# Altium schematic sheet MCU_USB.SchDoc
size A3
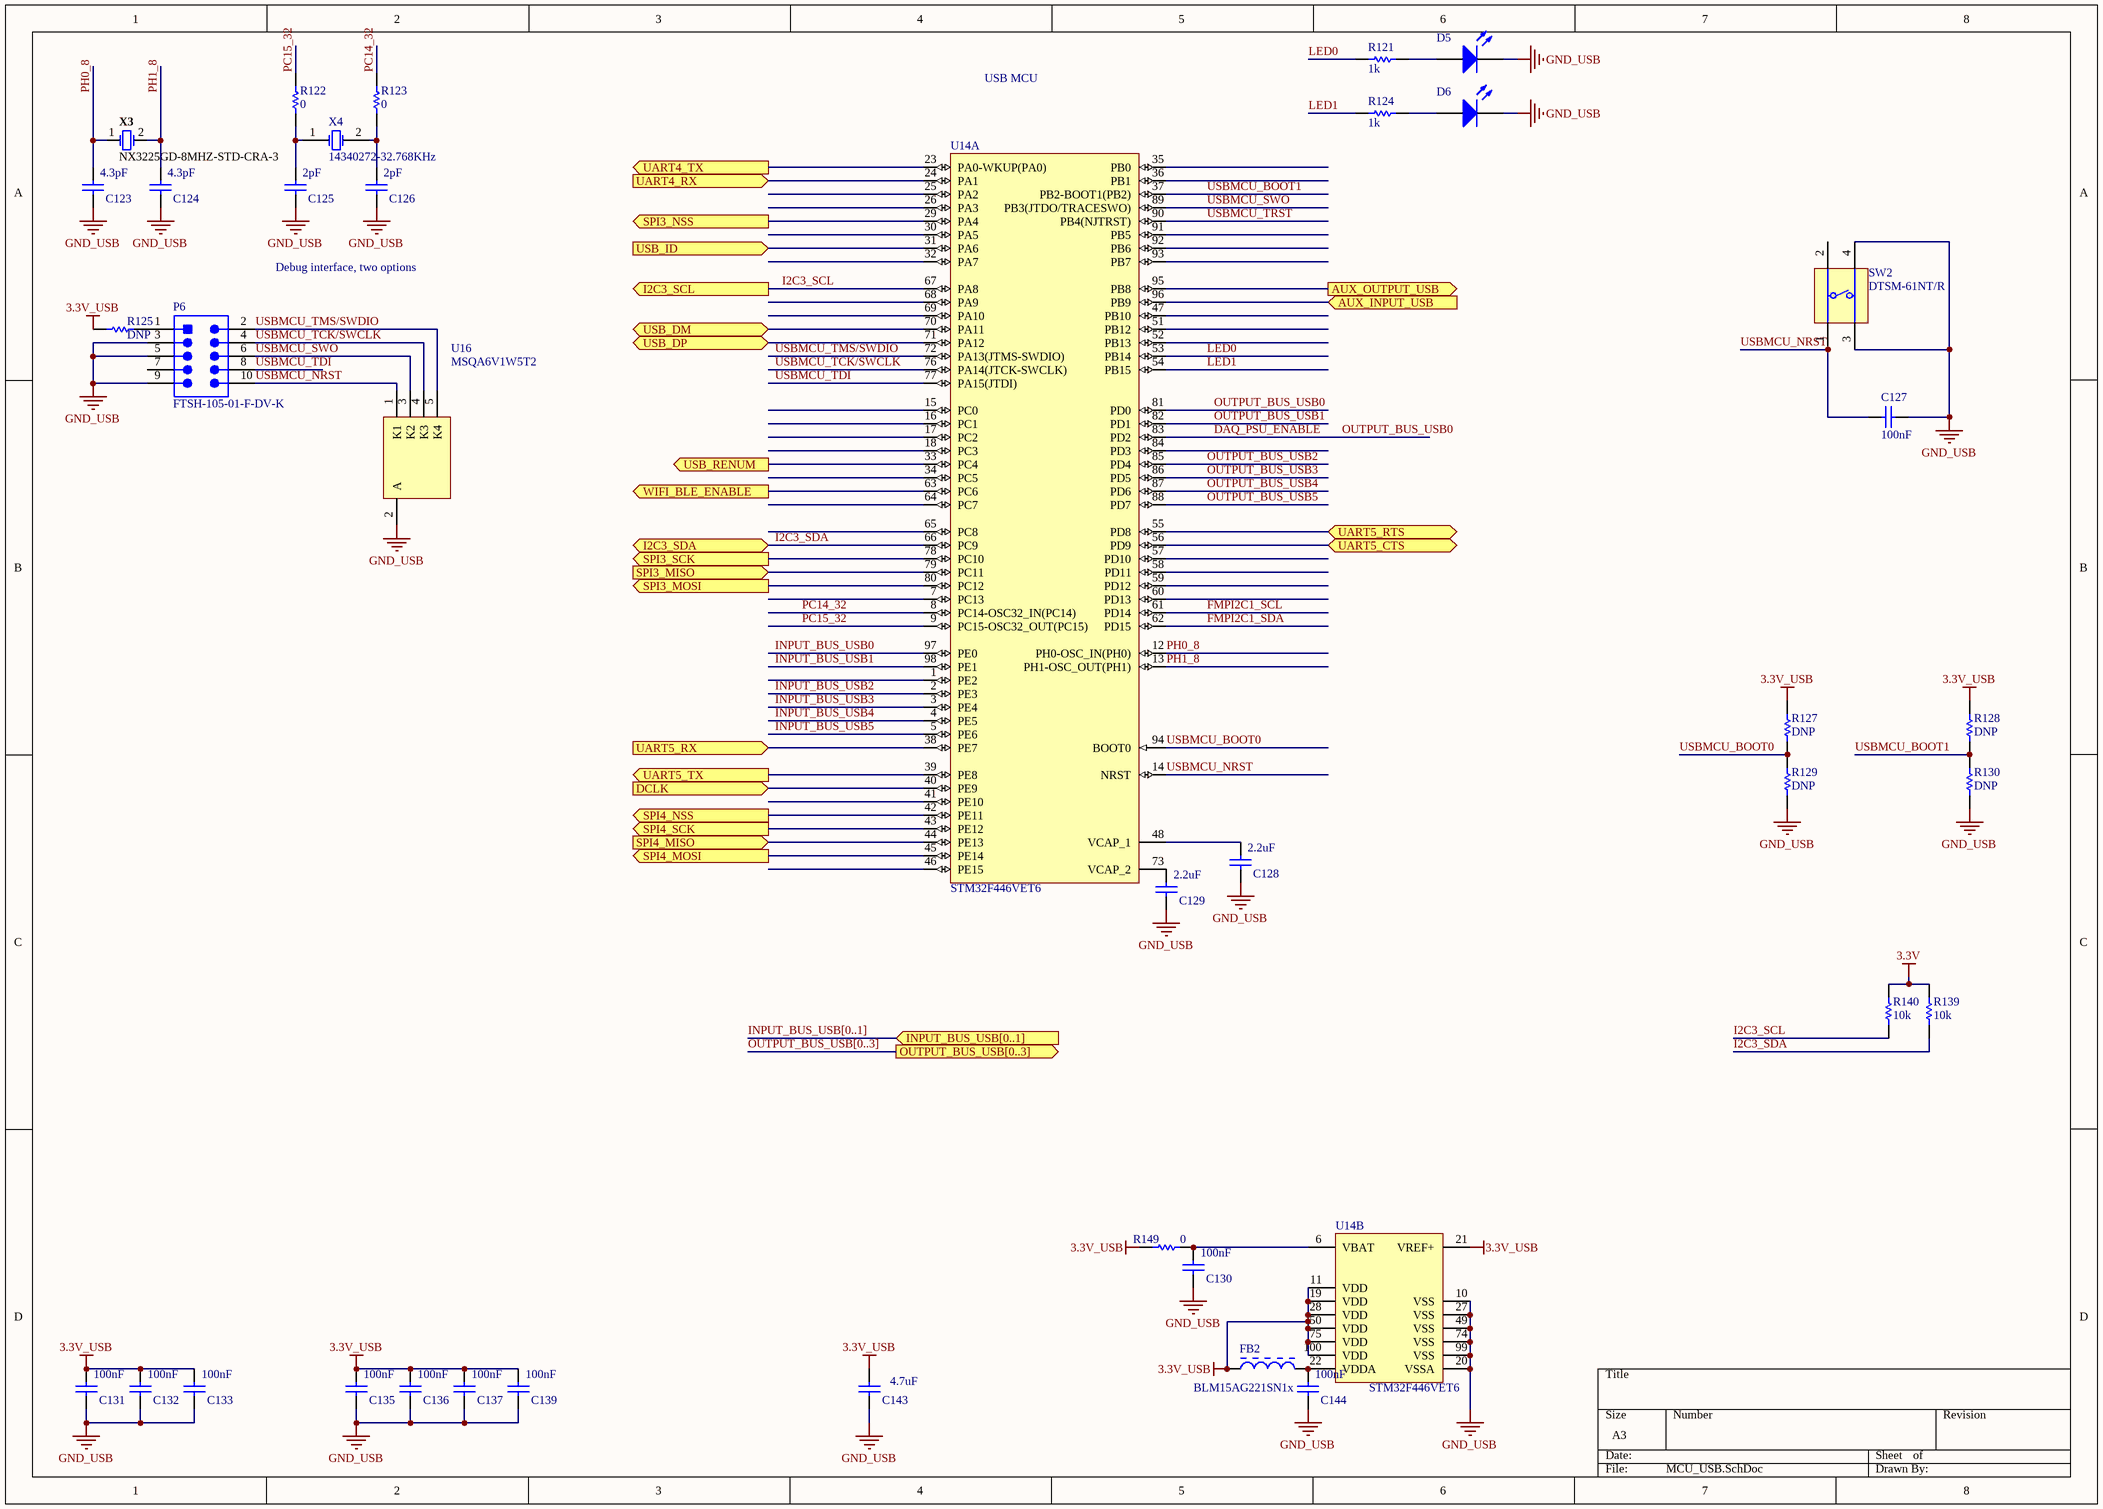
[diagram p0: MCU_USB.SchDoc]

## Parts
C123  value 4.3pF  [CAPC0402(1005)60_L]  (hidden comment: CAP0402)
C124  value 4.3pF  [CAPC0402(1005)60_L]  (hidden comment: CAP0402)
C125  value 2pF  [CAPC0402(1005)60_L]  (hidden comment: CAP0402)
C126  value 2pF  [CAPC0402(1005)60_L]  (hidden comment: CAP0402)
C127  value 100nF  [CAPC0402(1005)60_L]  (hidden comment: CAP0402)
C128  value 2.2uF  [CAPC0402(1005)60_L]  (hidden comment: CAP0402)
C129  value 2.2uF  [CAPC0402(1005)60_L]  (hidden comment: CAP0402)
C130  value 100nF  [CAPC0402(1005)60_L]  (hidden comment: CAP0402)
C131  value 100nF  [CAPC0402(1005)60_L]  (hidden comment: CAP0402)
C132  value 100nF  [CAPC0402(1005)60_L]  (hidden comment: CAP0402)
C133  value 100nF  [CAPC0402(1005)60_L]  (hidden comment: CAP0402)
C135  value 100nF  [CAPC0402(1005)60_L]  (hidden comment: CAP0402)
C136  value 100nF  [CAPC0402(1005)60_L]  (hidden comment: CAP0402)
C137  value 100nF  [CAPC0402(1005)60_L]  (hidden comment: CAP0402)
C139  value 100nF  [CAPC0402(1005)60_L]  (hidden comment: CAP0402)
C143  value 4.7uF  [CAPC0805(2012)145_L]  (hidden comment: CAP0805)
C144  value 100nF  [CAPC0402(1005)60_L]  (hidden comment: CAP0402)
D5  Green_LED_150060GS75000  [Green_LED_150060GS75000]  (value not drawn)
D6  Green_LED_150060GS75000  [Green_LED_150060GS75000]  (value not drawn)
FB2  BLM15AG221SN1x  [MURA-BLM15AG221SN1x_V]
P6  FTSH-105-01-F-DV-K  [SMTC-FTSH-105-01-L-DV-K_V]
R121  value 1k  [RESC0402(1005)_L]  (hidden comment: RES0402)
R122  value 0  [RESC0402(1005)_L]  (hidden comment: RES0402)
R123  value 0  [RESC0402(1005)_L]  (hidden comment: RES0402)
R124  value 1k  [RESC0402(1005)_L]  (hidden comment: RES0402)
R125  value DNP  [RESC0402(1005)_L]  (hidden comment: RES0402)
R127  value DNP  [RESC0402(1005)_L]  (hidden comment: RES0402)
R128  value DNP  [RESC0402(1005)_L]  (hidden comment: RES0402)
R129  value DNP  [RESC0402(1005)_L]  (hidden comment: RES0402)
R130  value DNP  [RESC0402(1005)_L]  (hidden comment: RES0402)
R139  value 10k  [RESC0402(1005)_L]  (hidden comment: RES0402)
R140  value 10k  [RESC0402(1005)_L]  (hidden comment: RES0402)
R149  value 0  [RESC0402(1005)_L]  (hidden comment: RES0402)
SW2  DTSM-61NT/R  [DIPT-DTSM-6_V]
U14  STM32F446VET6  [STM-LQFP100_M]  (parts A,B of 2)
U16  MSQA6V1W5T2  [ONSC-SC70-5-419A-02_V]
X3  NX3225GD-8MHZ-STD-CRA-3  [NDK-NX3225GD-8MHZ-STD-CRA-3_V]
X4  14340272-32.768KHz  [ITTI-14340272-32.768KHz-2_V]

## Ports
AUX_INPUT_USB (in), AUX_OUTPUT_USB (out), DCLK (in), I2C3_SCL (out), I2C3_SDA (bidir), INPUT_BUS_USB[0..1] (in), OUTPUT_BUS_USB[0..3] (out), SPI3_MISO (in), SPI3_MOSI (out), SPI3_NSS (out), SPI3_SCK (out), SPI4_MISO (in), SPI4_MOSI (out), SPI4_NSS (out), SPI4_SCK (out), UART4_RX (in), UART4_TX (out), UART5_CTS (bidir), UART5_RTS (bidir), UART5_RX (in), UART5_TX (out), USB_DM (bidir), USB_DP (bidir), USB_ID (in), USB_RENUM (out), WIFI_BLE_ENABLE (out)

## Nets
3.3V: R139.2 R140.2
3.3V_USB: C131.1 C132.1 C133.1 C135.1 C136.1 C137.1 C139.1 C143.2 FB2.1 R125.2 R127.2 R128.2 R149.2 U14.11(VDD) U14.19(VDD) U14.21(VREF+) U14.28(VDD) U14.50(VDD) U14.75(VDD) U14.100(VDD)
GND_USB: C123.2 C124.2 C125.2 C126.2 C127.2 C128.2 C129.2 C130.2 C131.2 C132.2 C133.2 C135.2 C136.2 C137.2 C139.2 C143.1 C144.2 D5.1 D6.1 P6.3 P6.5 P6.9 R129.1 R130.1 SW2.3(T3) SW2.4(T3) U14.10(VSS) U14.20(VSSA) U14.27(VSS) U14.49(VSS) U14.74(VSS) U14.99(VSS) U16.2(A)
AUX_INPUT_USB: U14.96(PB9) ; port AUX_INPUT_USB
AUX_OUTPUT_USB: U14.95(PB8) ; port AUX_OUTPUT_USB
DAQ_PSU_ENABLE: U14.81(PD0) U14.83(PD2)  [also labelled OUTPUT_BUS_USB0]
DCLK: U14.40(PE9) ; port DCLK
FMPI2C1_SCL: U14.61(PD14)
FMPI2C1_SDA: U14.62(PD15)
I2C3_SCL: R140.1 U14.67(PA8) ; port I2C3_SCL
I2C3_SDA: R139.1 U14.66(PC9) ; port I2C3_SDA
INPUT_BUS_USB0: U14.97(PE0)
INPUT_BUS_USB1: U14.98(PE1)
INPUT_BUS_USB2: U14.2(PE3)
INPUT_BUS_USB3: U14.3(PE4)
INPUT_BUS_USB4: U14.4(PE5)
INPUT_BUS_USB5: U14.5(PE6)
LED0: R121.1 U14.53(PB14)
LED1: R124.1 U14.54(PB15)
OUTPUT_BUS_USB1: U14.82(PD1)
OUTPUT_BUS_USB2: U14.85(PD4)
OUTPUT_BUS_USB3: U14.86(PD5)
OUTPUT_BUS_USB4: U14.87(PD6)
OUTPUT_BUS_USB5: U14.88(PD7)
PC14_32: R123.1 U14.8(PC14-OSC32_IN(PC14))
PC15_32: R122.1 U14.9(PC15-OSC32_OUT(PC15))
PH0_8: C123.1 U14.12(PH0-OSC_IN(PH0)) X3.1
PH1_8: C124.1 U14.13(PH1-OSC_OUT(PH1)) X3.2
SPI3_MISO: U14.79(PC11) ; port SPI3_MISO
SPI3_MOSI: U14.80(PC12) ; port SPI3_MOSI
SPI3_NSS: U14.29(PA4) ; port SPI3_NSS
SPI3_SCK: U14.78(PC10) ; port SPI3_SCK
SPI4_MISO: U14.44(PE13) ; port SPI4_MISO
SPI4_MOSI: U14.45(PE14) ; port SPI4_MOSI
SPI4_NSS: U14.42(PE11) ; port SPI4_NSS
SPI4_SCK: U14.43(PE12) ; port SPI4_SCK
UART4_RX: U14.24(PA1) ; port UART4_RX
UART4_TX: U14.23(PA0-WKUP(PA0)) ; port UART4_TX
UART5_CTS: U14.56(PD9) ; port UART5_CTS
UART5_RTS: U14.55(PD8) ; port UART5_RTS
UART5_RX: U14.38(PE7) ; port UART5_RX
UART5_TX: U14.39(PE8) ; port UART5_TX
USB_DM: U14.70(PA11) ; port USB_DM
USB_DP: U14.71(PA12) ; port USB_DP
USB_ID: U14.31(PA6) ; port USB_ID
USB_RENUM: U14.33(PC4) ; port USB_RENUM
USBMCU_BOOT0: R127.1 R129.2 U14.94(BOOT0)
USBMCU_BOOT1: R128.1 R130.2 U14.37(PB2-BOOT1(PB2))
USBMCU_NRST: C127.1 P6.10 SW2.1(T1) U14.14(NRST) U16.1(K1)
USBMCU_SWO: P6.6 U14.89(PB3(JTDO/TRACESWO)) U16.3(K2)
USBMCU_TCK/SWCLK: P6.4 U14.76(PA14(JTCK-SWCLK)) U16.4(K3)
USBMCU_TDI: P6.8 U14.77(PA15(JTDI))
USBMCU_TMS/SWDIO: P6.2 U14.72(PA13(JTMS-SWDIO)) U16.5(K4)
USBMCU_TRST: U14.90(PB4(NJTRST))
WIFI_BLE_ENABLE: U14.63(PC6) ; port WIFI_BLE_ENABLE
NetC125_1: C125.1 R122.2 X4.1(X1)
NetC126_1: C126.1 R123.2 X4.2(X2)
NetC128_1: C128.1 U14.48(VCAP_1)
NetC129_1: C129.1 U14.73(VCAP_2)
NetC130_1: C130.1 R149.1 U14.6(VBAT)
NetC144_1: C144.1 FB2.2 U14.22(VDDA)
NetD5_2: D5.2 R121.2
NetD6_2: D6.2 R124.2
NetP6_1: P6.1 R125.1

Not connected (* = marked no-connect by the designer): P6 7; SW2 2(T2); U14 1(PE2) 7(PC13) 15(PC0) 16(PC1) 17(PC2) 18(PC3) 25(PA2) 26(PA3) 30(PA5) 32(PA7) 34(PC5) 35(PB0) 36(PB1) 41(PE10) 46(PE15) 47(PB10) 51(PB12) 52(PB13) 57(PD10) 58(PD11) 59(PD12) 60(PD13) 64(PC7) 65(PC8) 68(PA9) 69(PA10) 84(PD3) 91(PB5) 92(PB6) 93(PB7)

## Buses and harness runs
bus INPUT_BUS_USB[0..1] = port INPUT_BUS_USB[0..1]
bus OUTPUT_BUS_USB[0..3] = port OUTPUT_BUS_USB[0..3]

## Notes on the sheet
- USB MCU
- Debug interface, two options

## Library data of the parts
C123-C133 C135-C137 C139 C144 = CMP-1590-00004-1: 0402 (1005 Metric) Chip Capacitor; Case-EIA: 0402; Case-Metric: 1005; PackageReference: CAPC0402(1005)60
C143 = CMP-1590-00003-1: 0805 (2012 Metric) Chip Capacitor; Case-EIA: 0805; Case-Metric: 2012; PackageReference: CAPC0805(2012)145
D5 D6 = Green_LED_150060GS75000: WURTH ELEKTRONIK  150060GS75000  LED, Green, SMD, 30 mA, 3.2 V, 520 nm; Unit Cost: 0.287; ComponentLinkURL1: http://ie.farnell.com/wurth-elektronik/150060gs75000/led-0603-green-430mcd-520nm/dp/2322070?ost=150060GS75000&selectedCategoryId=&categoryNameResp=All%2BCategories&searchView=table&iscrfnonsku=false; Manufacturer Part Number: 150060GS75000; Supplier 1: Farnell; Supplier Part Number 1: 2322070; Manufacturer: WURTH ELEKTRONIK
FB2 = CMP-1662-00018-3: Chip Bead, 220 Ohm, +/- 25 %, 100 MHz, 300 mA, -55 to 125 degC, 0402 (1005 Metric), RoHS; Tolerance: 25%; Current Rating: 200 mA; Max Current Rating: 450 mA; Resistance: 220 Ohm; Package Quantity: 10000; DatasheetVersion: 03/2011; Radiation Hardening: No; Case Code (Imperial): 0402; Length: 1 mm; RoHSCompliant: True; ComponentLink1URL: http://www.murata.com/; Case/Package: 0402; Width: 0.5 mm; Mounting Technology: Surface Mount; REACH SVHC: No SVHC; Height: 0.5 mm; ComponentLink2Description: Datasheet; PartNumber: BLM15AG221SN1x; ComponentLink1Description: Manufacturer URL; Max Operating Temperature: 125 degC; PackageDescription: 2-Pin Surface Mount Device, Body 1 x 0.5 mm; Case Code (Metric): 1005; ComponentLink2URL: https://datasheet.ciiva.com/11800/0900766b811b5866-11800858.pdf; Min Operating Temperature: -55 degC
P6 = CMP-2000-05352-1: Male Header, Pitch 1.27 mm, 2 x 5 Position, Height 6.12 mm, RoHS, Tube; Manufacturer: Samtec; Number of Positions: 10; Connector Type: Header,Shrouded; Number of Positions Loaded: All; Row Spacing: 0.050"(1.27mm); Fastening Type: -; Package Reference: FTSH-105-01-L-DV-K; Termination: Solder; Package URL: http://suddendocs.samtec.com/prints/ftsh-1xx-xx-xxx-dv-xxx-footprint.pdf; Number of Rows: 2; Contact Finish Thickness: 3µin(0.08µm); Contact Type: MalePin; Manufacturer URL: http://www.samtec.com/; Contact Mating Length: 0.120"(3.05mm); Pitch: 0.050"(1.27mm); Series: FTSH; Features: -; Contact Finish: Gold; Color: Black; Family: RectangularConnectors-Headers,MalePins; Datasheet URL: http://suddendocs.samtec.com/prints/ftsh-1xx-xx-xxx-dv-xxx-mkt.pdf; Package Description: Male Header, Pitch 1.27 mm, 2 x 5 Position, Height 5.97 mm, Tail Length 4.32 mm; Mounting Type: SurfaceMount; Datasheet Version: Rev. ET, 10/1995; Category: Connectors,Interconnects; Packaging: Tube
R121-R125 R127-R130 R139 R140 R149 = CMP-1591-00004-1: 0402 (1005 Metric) Chip Resistor; Case-EIA: 0402; Case-Metric: 1005; PackageReference: RESC0402(1005)
SW2 = CMP-0306-00001-1: Switch, SPNO Push Button SMD; Manufacturer: Diptronics; Packing Type: Tape&Reel; Mechanical Life: 200,000 cycles; ComponentLink2URL: http://www.dip.com.tw/Products_tact.htm; ComponentLink1URL: http://www.dip.com.tw/; ComponentLink3URL: http://www.dip.com.tw/PDF/pro_tact/DTSM_G_-6_2_-V.pdf; PackageDescription: Switch, Through-Hole, 4 Leads, Body 8.5x8.5mm, Row Spacing 9.0mm, Pitch 4.5mm; ComponentLink2Description: Datasheet; ComponentLink3Description: Package Specification; ComponentLink1Description: Manufacturer URL; PackageReference: DTSM-6; PartNumber: DTSM-61NT/R; Mounting Technology: Through Hole
U14 = CMP-0243-00220-1: ARM Cortex-M4 32-bit MCU+FPU, 512 KB Flash, 128 KB Internal RAM, 81 I/Os, 100-Pin LQFP, -40 to 85 degC, Tray; I/Os (High Current): 81; D/A Converter: 2; Internal RAM Size (kB): 128; FLASH Size (Prog) (kB): 512; Supply Voltage(Vcc) min (V): 1.7; Operating Frequency(F) (Processor speed) (MHz): 180; ComponentLink1Description: Manufacturer URL; ComponentLink1URL: http://www.st.com/; Core: ARM Cortex-M4; DatasheetVersion: Rev. 6; ComponentLink2Description: Datasheet; Package Description: LQFP100; Mounting Technology: Surface Mount; Package Reference: 100-Pin Low Profile Quad Flat Package, Body 14 x 14 mm, Pitch 0.5 mm; Packing: Tray; ComponentLink2URL: http://www.st.com/st-web-ui/static/active/en/resource/technical/document/datasheet/DM00141306.pdf
U16 = CMP-1060-00060-1: Quad Array ESD Protection Diodes with Low Clamping Voltage, 5-Pin SC70, Tape and Reel; Manufacturer: On Semiconductor; P Max (W): 0.385; Packing: Tape and Reel; DatasheetVersion: Rev. 7; ComponentLink2URL: http://www.onsemi.com/pub_link/Collateral/MSQA6V1W5T2-D.PDF; PackageDescription: 5-Pin Small Outline Transistor, Body 2 x 1.25 mm, Pitch 0.65 mm; PackageVersion: Rev. L, 01/2013; ComponentLink1URL: http://www.onsemi.com/; ComponentLink2Description: Datasheet; ComponentLink3Description: Package Specification; Mounting Technology: Surface Mount; ComponentLink1Description: Manufacturer URL; PackageReference: SC70-5-419A-02; PartNumber: MSQA6V1W5T2; ComponentLink3URL: http://www.onsemi.cn/pub_link/Collateral/419A-02.PDF
X3 = CMP-2000-07595-1: Crystal Unit, 8 MHz, 8 pF, -40 to 150 degC, 2-Pin SMD, RoHS, Tape and Reel; Manufacturer: NDK; Load Capacitance: 8pF; ESR (Equivalent Series Resistance): 500Ohm; Frequency Tolerance: 50ppm; Frequency Stability: 150ppm; Frequency: 8MHz; Case/Package: SMD/SMT; Datasheet Version: 11/2016; Min Operating Temperature: -40degC; Packaging: TapeandReel; Width: 0.098inch; Package Quantity: 3000; Number of Pins: 2; Package Description: 2-Pin Surface Mount Device, Body 3.2 x 2.5 mm; RoHSCompliant: True; Package Reference: NX3225GD-8MHZ-STD-CRA-3; Datasheet URL: http://www.ndk.com/images/products/catalog/c_NX3225GD-STD-CRA-3_e.pdf; Mounting Technology: SurfaceMount; Length: 0.126inch; Mount: SurfaceMount; Manufacturer URL: http://www.ndk.com/en/; Max Operating Temperature: 150degC; Height: 0.039inch
X4 = CMP-0463-00001-2: Crystal, 32.768 KHz, -40 to 85 degC, 3.2 x 1.5 x 0.9 mm SMD; Manufacturer: ITTI; Load Capacitance: 12.5 pF; Frequency Tolerance: +/-20 ppm; Drive Level: 1 max. uw; Nominal Frequency: 32.768KHz; Mounting Technology: Surface Mount; Operating temperature: -40 to 85 degC; PartNumber: 14340272-32.768KHz; ComponentLink1URL: http://www.itti-co.com; ComponentLink1Description: Manufacturer URL; PackageReference: 14340272-32.768KHz-2; PackageDescription: 2-Pin Hand Drawn, Body 3.2 x 1.5mm, Pitch 2.5 mm